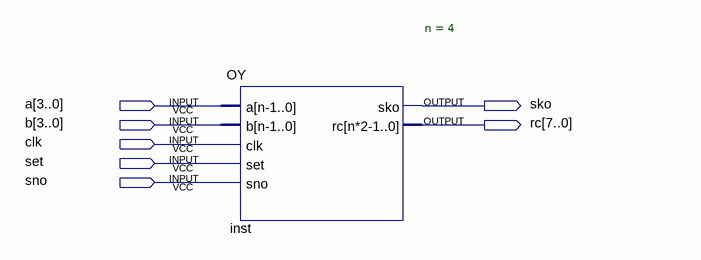
[diagram p0: schematic sheet]
// Quartus schematic OY_scheme.bdf as structural Verilog: 1 symbols, 7 pins
module OY_scheme (
  input  [3:0] a,
  input  [3:0] b,
  input  clk,
  input  set,
  input  sno,
  output sko,
  output [7:0] rc
);

  OY #(.n(4)) inst (.a(a), .b(b), .clk(clk), .set(set), .sno(sno), .sko(sko), .rc(rc));
endmodule
